# EAGLE design pwm.driver (EAGLE 9.0.1)
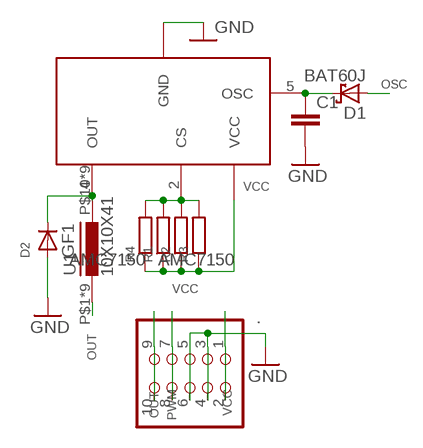
[diagram p0: schematic, sheet 1]

## Parts
.  PINHD-2X5  [2X05]
AMC7150  AMC7150  [TO-252-5L]
C1  C-EU025-024X044  [C025-024X044]
D1  BAT60J  [SOD323_ST]
D2  GF1  [SMA-DO214AC]
R1  R-EU_R1206  [R1206]
R2  R-EU_R1206  [R1206]
R3  R-EU_R1206  [R1206]
R4  R-EU_R1206  [R1206]
U1  10X10X41  [10X10X4]

## Nets
CS: AMC7150.2(CS) R1.2 R2.2 R3.2 R4.2
GND: ..3 ..4 ..5 ..6 AMC7150.3(GND) AMC7150.TAB(GND) C1.2 D2.A
N$1: AMC7150.4(OUT) D2.K(C) U1.P$10 U1.P$11 U1.P$12 U1.P$13 U1.P$14 U1.P$15 U1.P$16 U1.P$17 U1.P$18
OSC: AMC7150.5(OSC) C1.1 D1.C
OUT: ..9 ..10 U1.P$1 U1.P$2 U1.P$3 U1.P$4 U1.P$5 U1.P$6 U1.P$7 U1.P$8 U1.P$9
PWM: ..7 ..8 D1.A
VCC: ..1 ..2 AMC7150.1(VCC) R1.1 R2.1 R3.1 R4.1

## Library data of the parts
. = pinhead:PINHD-2X5: PIN HEADER
AMC7150 = diy-modules:AMC7150
C1 = rcl:C-EU: CAPACITOR, European symbol; SPICEPREFIX: C
D1 = diode:BAT60J: Schottky barrier diode Source: www.st.com, BAT60J.pdf
D2 = diode:GF1: DIODE
R1-R4 = rcl:R-EU_: RESISTOR, European symbol; SPICEPREFIX: R
U1 = inductors-2:10X10X4

## Net classes
0 default: width 0.406 mm, drill 0.406 mm, clearance 0.406 mm
3 power usb: width 0.508 mm, drill 0.406 mm, clearance 0.203 mm

## Board
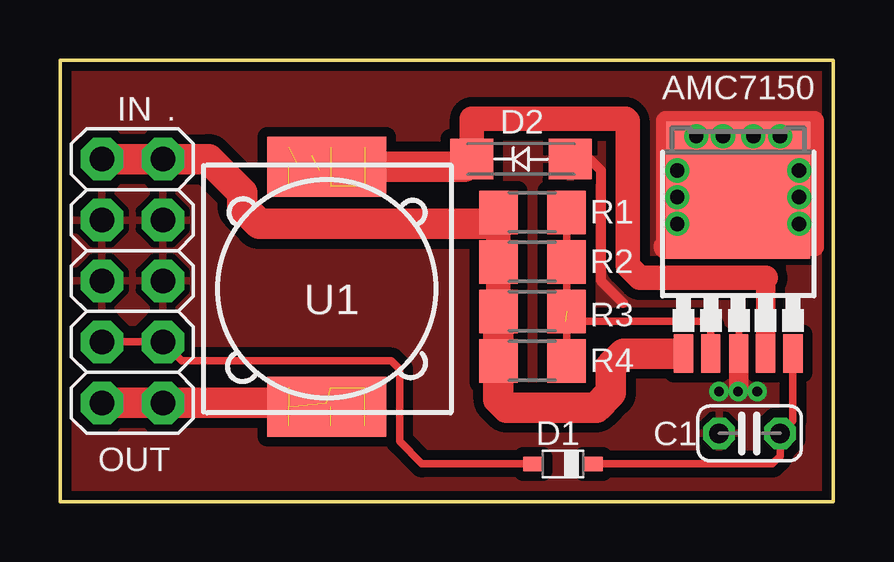
[diagram p1: board, top side]
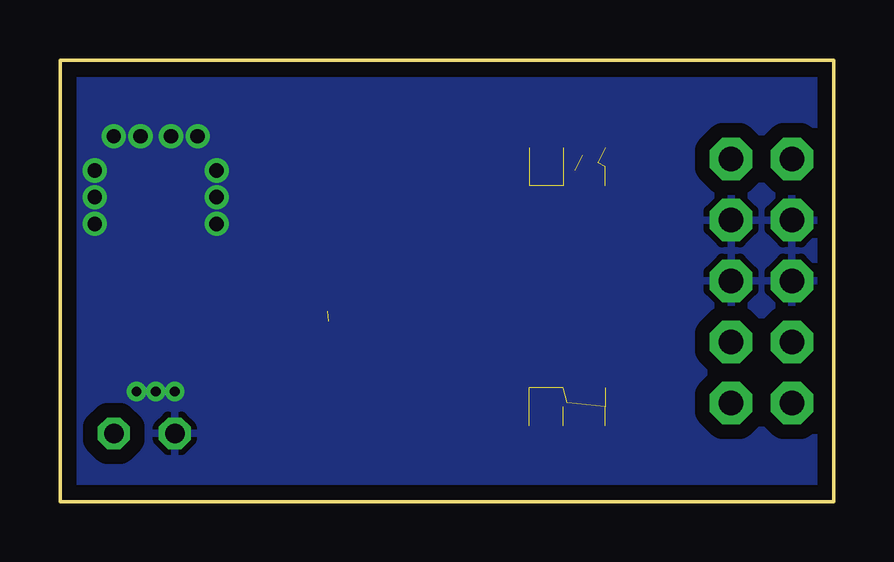
[diagram p2: board, bottom side, seen from below]

Size 32.23 x 18.42 mm. Coordinates in mm from the lower left corner, seen from the top.
Outline: 0,0 32.23,0 32.23,18.42 0,18.42 0,0
Copper layers (1*16): Top 0.035mm / dielectric 1.5mm / Bottom 0.035mm
Design rules "default *": minimum track width 4mil, minimum drill 0.35mm, track to track 4mil, track to pad 4mil, pad to pad 4mil, via to via 4mil, smd to smd 6mil, copper to edge 15mil, drill to drill 6mil, minimum pad ring 10mil, minimum via ring 8mil, stop-mask expansion 4mil, vias tented up to drill 0mil, thermal gap 10mil

### Footprints (pad centres in the part's own frame; a part is rotated, then mirrored left to right if it is on the bottom)
2X05 = drill 1.016 pad 1.778 octagon: 1 -5.08,-1.27; 2 -5.08,1.27; 3 -2.54,-1.27; 4 -2.54,1.27; 5 0,-1.27; 6 0,1.27; 7 2.54,-1.27; 8 2.54,1.27; 9 5.08,-1.27; 10 5.08,1.27
TO-252-5L = smd 0.8 x 1.6: 1 -2.28,-6.045; 2 -1.14,-6.045; 3 0.029,-6.045; 4 1.14,-6.045; 5 2.28,-6.045 | smd 6 x 5.715: TAB 0,0.762
C025-024X044 = drill 0.813 octagon: 1 -1.27,0; 2 1.27,0
SOD323_ST = smd 0.8 x 0.6: A 1.25,0; C -1.25,0
SMA-DO214AC = smd 1.8 x 1.7: A -2.05,0; K 2.05,0
R1206 = smd 1.6 x 1.803: 1 -1.422,0; 2 1.422,0
10X10X4 = smd 1.778 x 0.914: P$1 -1.905,-5.874; P$2 -0.159,-5.874; P$3 1.27,-5.874; P$4 -1.905,-5.08; P$5 -0.159,-5.08; P$6 1.27,-5.08; P$7 -1.905,-4.286; P$8 -0.159,-4.286; P$9 1.27,-4.286; P$10 -1.905,4.128; P$11 -0.159,4.128; P$12 1.27,4.128; P$13 -1.905,4.921; P$14 -0.159,4.921; P$15 1.27,4.921; P$16 -1.905,5.715; P$17 -0.159,5.715; P$18 1.27,5.715

### Placement (x,y rotation side)
.  3.02,9.21 270 top
AMC7150  28.26,12.22 0 top
C1  28.73,2.86 180 top
D1  20.96,1.59 180 top
D2  19.21,14.29 180 top
R1  19.68,12.06 0 top
R2  19.68,10 0 top
R3  19.68,7.94 0 top
R4  19.68,5.87 0 top
U1  11.43,9.05 0 top

### Tracks (layer width: path | path; a pad name or v marks a point on that pad's centre or on a via)
CS  (1 unrouted)
  Top 0.152: 27.15,6.21 AMC7150.2
  Top 0.305: R1.2 R2.2 R3.2 R4.2 | AMC7150.2 27.12,7.33 26.91,7.54 21.06,7.54
GND  (via drill 0.4, 0.6)
  Top 0.254: 28.26,8.26 28.29,8.23 AMC7150.3
  Top 0.406: D2.A 22.07,14.29 22.54,13.82 22.54,9.22 23.46,8.3
  Top 0.61: 28.26,6.21 AMC7150.3
  Top 0.813: AMC7150.3 28.29,4.63 | 25.24,10.64 25.24,15.88 31.43,15.88 31.43,10.64
  Top 1.016: 25.24,10.64 25.72,11.11 v25.72,11.59
  Bottom 0.305: 28.73,4.6 v28.26,4.6 27.62,4.6
  other vias: 26.51,15.24 27.62,15.24 28.89,15.24 30,15.24 25.72,13.81 25.72,12.7 30.8,13.81 30.8,12.7 30.8,11.59 27.46,4.6 29.05,4.6
  pour Bottom (isolate 0.61): 0,18.42 32.23,18.42 32.23,0 0,0
  pour Top: 0,18.42 32.23,18.42 32.23,0 0,0
N$1  (9 unrouted)
  Top 0.2: 10.79,13.81 U1.P$14
  Top 0.508: 29.4,9.34 29.37,9.21
  Top 0.813: AMC7150.4 29.4,9.34 | 23.56,15.96 23.65,15.88
  Top 1.016: 10.48,14.45 9.84,14.13 | D2.K 17.16,15.96 23.56,15.96 | 23.65,15.88 23.65,9.84 24.16,9.34 29.4,9.34
  Top 1.27: D2.K 16.84,13.97 U1.P$15
OSC
  Top 0.305: AMC7150.5 30.54,3.39 C1.1 30,1.91 29.69,1.59 D1.C
OUT  (8 unrouted)
  Top 1.27: ..9 ..10 11.11,4.13 U1.P$5
PWM
  Top 0.305: ..7 ..8 5.08,5.87 13.81,5.87 14.15,5.54 14.15,2.52 15.08,1.59 D1.A
VCC
  Top 0.813: AMC7150.1 25.68,6.18
  Top 1.016: R3.1 R2.1 R1.1
  Top 1.27: ..1 ..2 6.19,14.29 7.59,12.88 7.59,12.29 8.29,11.59 17.79,11.59 R1.1 | R3.1 R4.1 18.26,4.28 18.61,3.93 22.34,3.93 22.95,4.54 22.95,5.64 23.48,6.18 25.68,6.18

### Text on the board
tPlace: IN | OUT